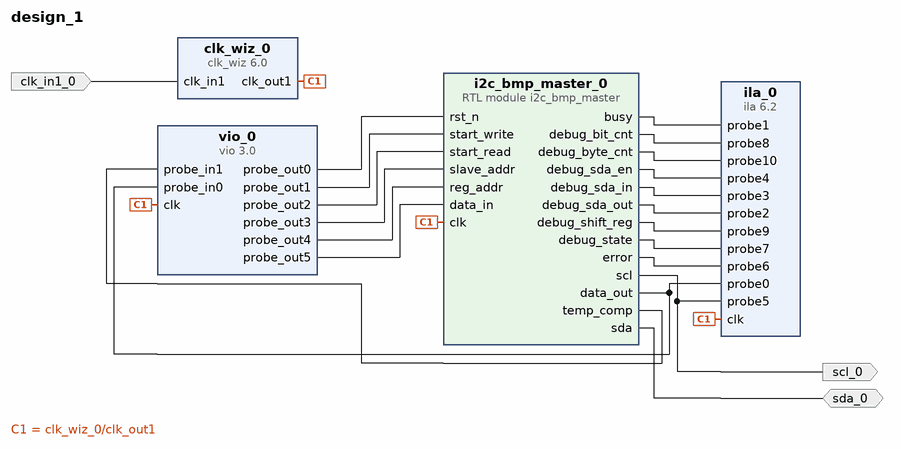
[diagram p0: block diagram of the top level]
# Vivado block design design_1, xc7a50tftg256-1, Vivado 2022.1
create_bd_design design_1

create_bd_port -dir I -type clk clk_in1_0
set_property -dict {CONFIG.FREQ_HZ 200000000} [get_bd_ports clk_in1_0]
create_bd_port -dir O scl_0
create_bd_port -dir IO sda_0

create_bd_cell -type ip -vlnv xilinx.com:ip:clk_wiz:6.0 clk_wiz_0
set_property -dict [list \
  CONFIG.CLKIN1_JITTER_PS 50.0 \
  CONFIG.CLKOUT1_JITTER 112.316 \
  CONFIG.CLKOUT1_PHASE_ERROR 89.971 \
  CONFIG.MMCM_CLKFBOUT_MULT_F 5.000 \
  CONFIG.MMCM_CLKIN1_PERIOD 5.000 \
  CONFIG.MMCM_CLKIN2_PERIOD 10.0 \
  CONFIG.PRIM_IN_FREQ 200.000 \
  CONFIG.USE_LOCKED false \
  CONFIG.USE_RESET false \
] [get_bd_cells clk_wiz_0]
create_bd_cell -type ip -vlnv xilinx.com:ip:vio:3.0 vio_0
set_property -dict [list \
  CONFIG.C_NUM_PROBE_IN 2 \
  CONFIG.C_NUM_PROBE_OUT 6 \
  CONFIG.C_PROBE_OUT3_WIDTH 8 \
  CONFIG.C_PROBE_OUT4_WIDTH 8 \
  CONFIG.C_PROBE_OUT5_WIDTH 8 \
] [get_bd_cells vio_0]
create_bd_cell -type ip -vlnv xilinx.com:ip:ila:6.2 ila_0
set_property -dict [list \
  CONFIG.C_DATA_DEPTH 16384 \
  CONFIG.C_ENABLE_ILA_AXI_MON false \
  CONFIG.C_MONITOR_TYPE Native \
  CONFIG.C_NUM_OF_PROBES 11 \
  CONFIG.C_PROBE0_WIDTH 20 \
  CONFIG.C_PROBE10_WIDTH 2 \
  CONFIG.C_PROBE7_WIDTH 4 \
  CONFIG.C_PROBE8_WIDTH 4 \
  CONFIG.C_PROBE9_WIDTH 8 \
] [get_bd_cells ila_0]
create_bd_cell -type module -reference i2c_bmp_master i2c_bmp_master_0

# ---- connections ----

connect_bd_net [get_bd_ports sda_0] [get_bd_pins i2c_bmp_master_0/sda]
connect_bd_net -net clk_in1_0_1 [get_bd_ports clk_in1_0] [get_bd_pins clk_wiz_0/clk_in1]
connect_bd_net [get_bd_pins clk_wiz_0/clk_out1] [get_bd_pins vio_0/clk] [get_bd_pins ila_0/clk] [get_bd_pins i2c_bmp_master_0/clk]
connect_bd_net [get_bd_pins i2c_bmp_master_0/busy] [get_bd_pins ila_0/probe1]
connect_bd_net [get_bd_pins i2c_bmp_master_0/debug_bit_cnt] [get_bd_pins ila_0/probe8]
connect_bd_net [get_bd_pins i2c_bmp_master_0/debug_byte_cnt] [get_bd_pins ila_0/probe10]
connect_bd_net [get_bd_pins i2c_bmp_master_0/debug_sda_en] [get_bd_pins ila_0/probe4]
connect_bd_net [get_bd_pins i2c_bmp_master_0/debug_sda_in] [get_bd_pins ila_0/probe3]
connect_bd_net [get_bd_pins i2c_bmp_master_0/debug_sda_out] [get_bd_pins ila_0/probe2]
connect_bd_net [get_bd_pins i2c_bmp_master_0/debug_shift_reg] [get_bd_pins ila_0/probe9]
connect_bd_net [get_bd_pins i2c_bmp_master_0/debug_state] [get_bd_pins ila_0/probe7]
connect_bd_net [get_bd_pins i2c_bmp_master_0/error] [get_bd_pins ila_0/probe6]
connect_bd_net [get_bd_pins i2c_bmp_master_0/scl] [get_bd_ports scl_0] [get_bd_pins ila_0/probe5]
connect_bd_net [get_bd_pins i2c_bmp_master_0/temp_comp] [get_bd_pins vio_0/probe_in1]
connect_bd_net -net i2c_eeprom_master_0_data_out [get_bd_pins i2c_bmp_master_0/data_out] [get_bd_pins vio_0/probe_in0] [get_bd_pins ila_0/probe0]
connect_bd_net [get_bd_pins vio_0/probe_out0] [get_bd_pins i2c_bmp_master_0/rst_n]
connect_bd_net [get_bd_pins vio_0/probe_out1] [get_bd_pins i2c_bmp_master_0/start_write]
connect_bd_net [get_bd_pins vio_0/probe_out2] [get_bd_pins i2c_bmp_master_0/start_read]
connect_bd_net [get_bd_pins vio_0/probe_out3] [get_bd_pins i2c_bmp_master_0/slave_addr]
connect_bd_net [get_bd_pins vio_0/probe_out4] [get_bd_pins i2c_bmp_master_0/reg_addr]
connect_bd_net [get_bd_pins vio_0/probe_out5] [get_bd_pins i2c_bmp_master_0/data_in]

validate_bd_design
save_bd_design
